# EAGLE design SparkFun_XBee_Serial_Explorer (EAGLE 7.5.0)
Assembly variants: Attributes
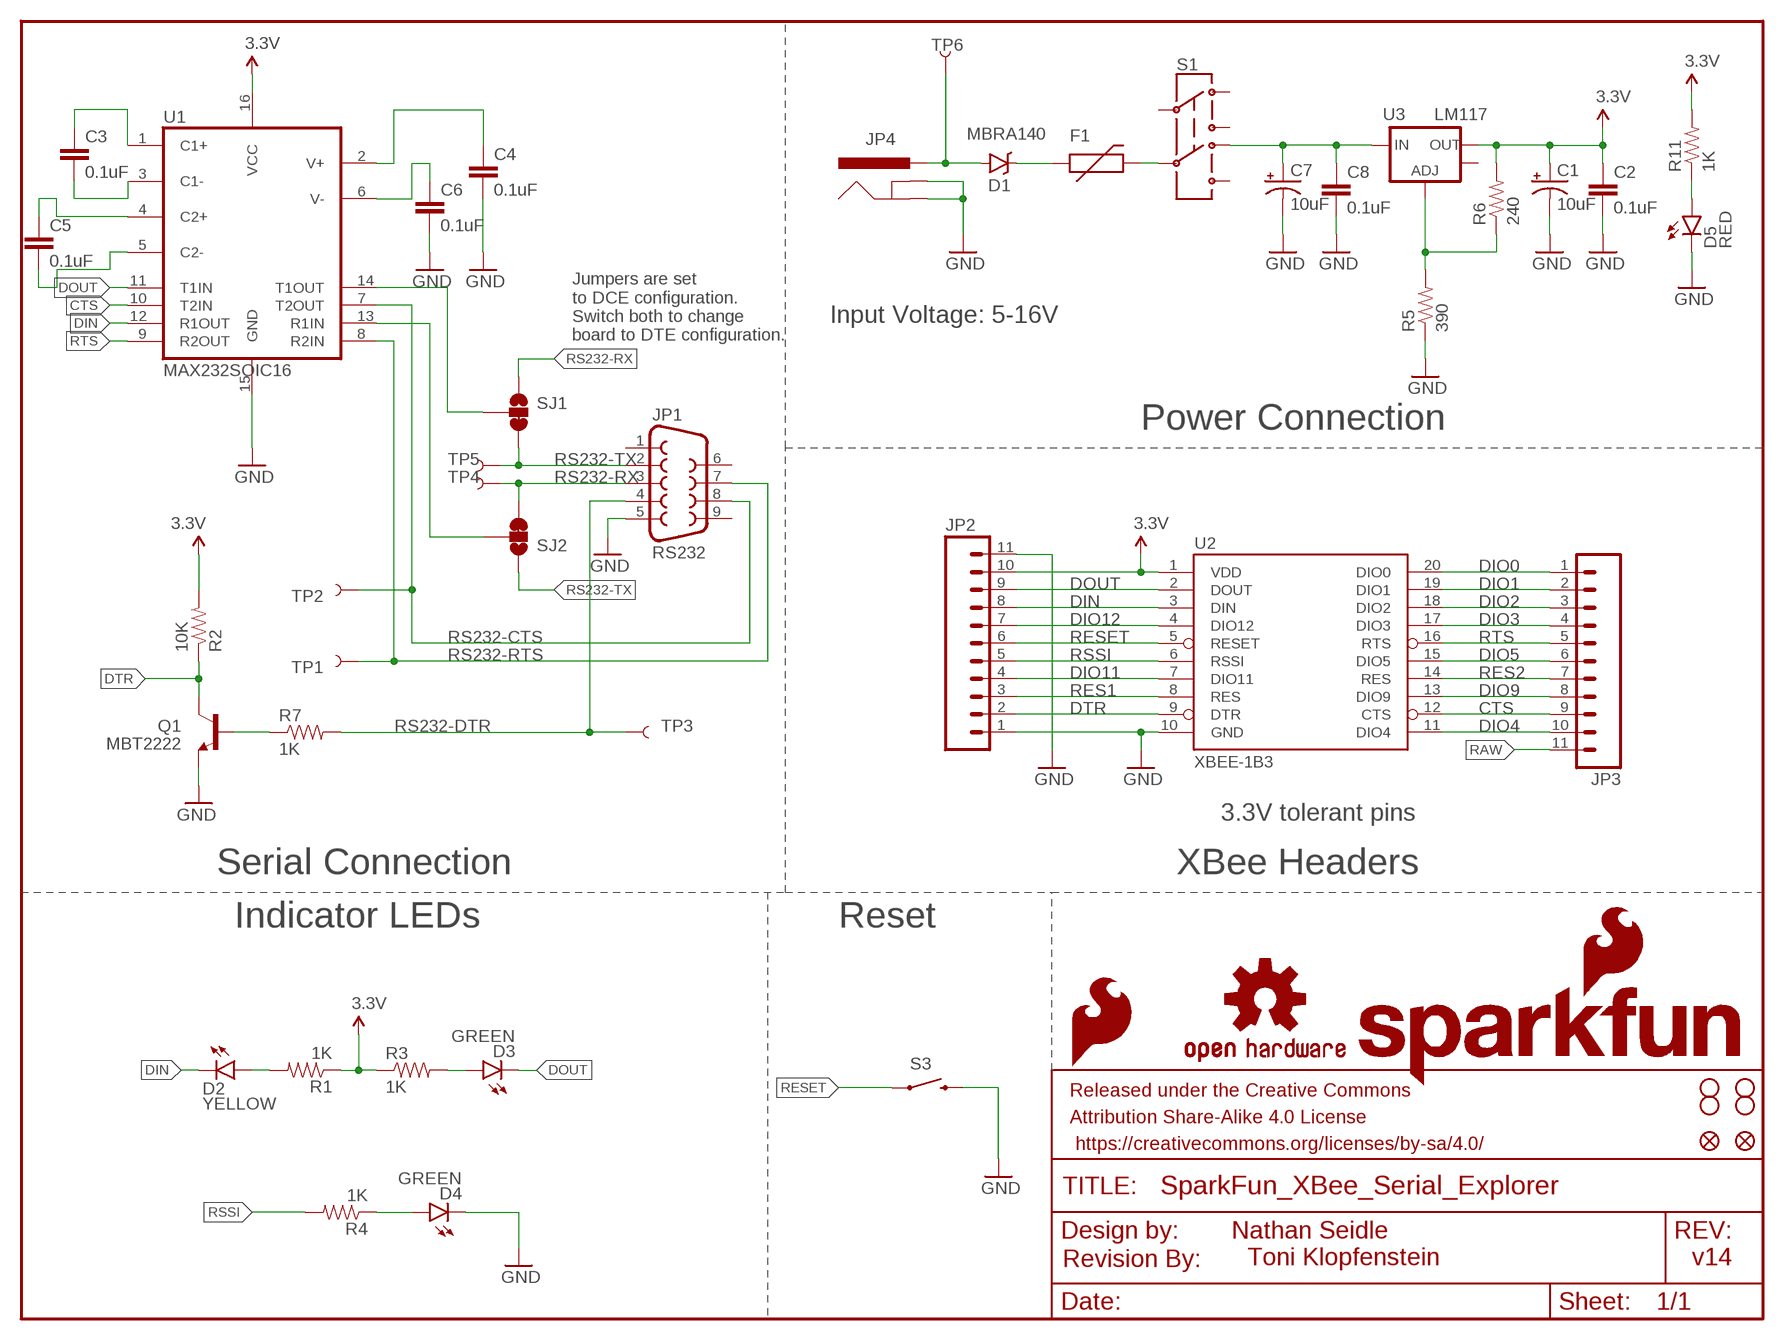
[diagram p0: schematic, sheet 1]

## Parts
C1  10uF  10UF-16V-10%(TANT)  [EIA3216]
C2  0.1uF  0.1UF-25V(+80/-20%)(0603)  [0603-CAP]
C3  0.1uF  0.1UF-25V(+80/-20%)(0603)  [0603-CAP]
C4  0.1uF  0.1UF-25V(+80/-20%)(0603)  [0603-CAP]
C5  0.1uF  0.1UF-25V(+80/-20%)(0603)  [0603-CAP]
C6  0.1uF  0.1UF-25V(+80/-20%)(0603)  [0603-CAP]
C7  10uF  10UF-16V-10%(TANT)  [EIA3216]
C8  0.1uF  0.1UF-25V(+80/-20%)(0603)  [0603-CAP]
D1  MBRA140  DIODE-SCHOTTKY-MBRA140  [SMA-DIODE]
D2  YELLOW  LED-YELLOWLARGE  [LED-1206]
D3  GREEN  LED-GREENLARGE  [LED-1206]
D4  GREEN  LED-GREENLARGE  [LED-1206]
D5  RED  LED-RED1206  [LED-1206]
F1  PTCTHERMISTOR1206  [PTC-1206]
FRAME1  FRAME-LETTER  [CREATIVE_COMMONS]
JP1  RS232  DB9FEMALE  [DB9]
JP2  M11PTH  [1X11]
JP3  M11PTH  [1X11]
JP4  POWER_JACKPTH_LOCK  [POWER_JACK_PTH_LOCK]
LOGO1  OSHW-LOGOL  [OSHW-LOGO-L]
LOGO2  SFE_LOGO_NAME_FLAME.2_INCH  [SFE_LOGO_NAME_FLAME_.2]
LOGO3  SFE_LOGO_FLAME.1_INCH  [SFE_LOGO_FLAME_.1]
Q1  MBT2222  TRANSISTOR_NPNSOT23-3  [SOT23-3]
R1  1K  1KOHM-1/10W-1%(0603)  [0603-RES]
R2  10K  10KOHM-1/10W-1%(0603)0603  [0603-RES]
R3  1K  1KOHM-1/10W-1%(0603)  [0603-RES]
R4  1K  1KOHM-1/10W-1%(0603)  [0603-RES]
R5  390  390OHM1/10W1%(0603)  [0603-RES]
R6  240  240OHM1/10W1%(0603)  [0603-RES]
R7  1K  1KOHM-1/10W-1%(0603)  [0603-RES]
R11  1K  1KOHM-1/10W-1%(0603)  [0603-RES]
S1  AYZ0202  [AYZ0202]
S3  TAC_SWITCHSMD  SWITCH-MOMENTARY-2SMD-REDUNDANT  [TACTILE-SWITCH-SMD]
SJ1  JUMPER-PAD-3-2OF3_NC_BY_TRACE_SMALL  [PAD-JUMPER-3-2OF3_NC_BY_TRACE_YES_SILK_FULL_BOX]
SJ2  JUMPER-PAD-3-2OF3_NC_BY_TRACE_SMALL  [PAD-JUMPER-3-2OF3_NC_BY_TRACE_YES_SILK_FULL_BOX]
TP1  TEST-POINTTP_15TH_THRU  [TP_15TH]
TP2  TEST-POINTTP_15TH_THRU  [TP_15TH]
TP3  TEST-POINTTP_15TH_THRU  [TP_15TH]
TP4  TEST-POINTTP_15TH_THRU  [TP_15TH]
TP5  TEST-POINTTP_15TH_THRU  [TP_15TH]
TP6  TEST-POINTTP_15TH_THRU  [TP_15TH]
U1  MAX232SOIC16  [SO016]
U2  XBEE-1B3  [XBEE-SMD]
U3  LM117  V_REG_LM1117SOT223  [SOT223]
U$1  REVISION  [REVISION]
U$5  STAND-OFF  [STAND-OFF]
U$7  FIDUCIAL1X2  [FIDUCIAL-1X2]
U$9  STAND-OFF  [STAND-OFF]
U$10  STAND-OFF  [STAND-OFF]
U$11  STAND-OFF  [STAND-OFF]
U$16  FIDUCIAL1X2  [FIDUCIAL-1X2]

## Nets
3.3V [vcc]: C1.A(+) C2.1 JP2.10 R1.1 R2.2 R3.1 R6.2 R11.2 U1.16(VCC) U2.1(VDD) U3.2(OUT)
CTS: JP3.9 U1.10(T2IN) U2.12(CTS)
DIN: D2.C JP2.8 U1.12(R1OUT) U2.3(DIN)
DIO0: JP3.1 U2.20(DIO0)
DIO1: JP3.2 U2.19(DIO1)
DIO2: JP3.3 U2.18(DIO2)
DIO3: JP3.4 U2.17(DIO3)
DIO4: JP3.10 U2.11(DIO4)
DIO5: JP3.6 U2.15(DIO5)
DIO9: JP3.8 U2.13(DIO9)
DIO11: JP2.4 U2.7(DIO11)
DIO12: JP2.7 U2.4(DIO12)
DOUT: D3.C JP2.9 U1.11(T1IN) U2.2(DOUT)
DTR: JP2.2 Q1.3(C) R2.1 U2.9(DTR)
GND [vcc]: C1.C(-) C2.2 C4.2 C6.2 C7.C(-) C8.2 D4.C D5.C JP1.5 JP2.1 JP2.11 JP4.GND JP4.GNDBREAK Q1.2(E) R5.1 S3.3 S3.4 U1.15(GND) U2.10(GND)
N$1: D2.A R1.2
N$2: D4.A R4.1
N$3: C3.1 U1.1(C1+)
N$4: D3.A R3.2
N$5: C3.2 U1.3(C1-)
N$6: C5.1 U1.4(C2+)
N$7: C5.2 U1.5(C2-)
N$8: C6.1 U1.6(V-)
N$9: C4.1 U1.2(V+)
N$10: R5.2 R6.1 U3.1(ADJ)
N$11: F1.2 S1.5
N$12: Q1.1(B) R7.1
N$13: SJ2.2 U1.13(R1IN)
N$14: SJ1.2 U1.14(T1OUT)
N$15: D1.A JP4.PWR TP6.P$1
N$16: D1.C F1.1
N$38: D5.A R11.1
RAW [vcc]: C7.A(+) C8.1 JP3.11 S1.6 U3.3(IN)
RES1: JP2.3 U2.8(RES)
RES2: JP3.7 U2.14(RES)
RESET: JP2.6 S3.1 S3.2 U2.5(RESET)
RS232-CTS: JP1.8 TP2.P$1 U1.7(T2OUT)
RS232-DTR: JP1.4 R7.2 TP3.P$1
RS232-RTS: JP1.7 TP1.P$1 U1.8(R2IN)
RS232-RX: JP1.3 SJ1.1 SJ2.3 TP4.P$1
RS232-TX: JP1.2 SJ1.3 SJ2.1 TP5.P$1
RSSI: JP2.5 R4.2 U2.6(RSSI)
RTS: JP3.5 U1.9(R2OUT) U2.16(RTS)
Unconnected: JP1.1 JP1.6 JP1.9 S1.1 S1.2 S1.3 S1.4 U3.4(OUT)

## Notes on the sheet
- Input Voltage: 5-16V
- Jumpers are set 
  to DCE configuration. 
  Switch both to change 
  board to DTE configuration.
- Power Connection
- 3.3V tolerant pins
- Serial Connection | XBee Headers
- Indicator LEDs | Reset
- Nathan Seidle
- Toni Klopfenstein | v14

## Library data of the parts
C1 C7 = SparkFun-Capacitors:10UF-16V-10%(TANT): CAP-00811 1206/EIA-3216 Tantalum capacitor; PROD_ID: CAP-00811
C2-C6 C8 = SparkFun-Capacitors:0.1UF-25V(+80/-20%)(0603): CAP-00810 Ceramic Standard decoupling cap; PROD_ID: CAP-00810
D1 = SparkFun-DiscreteSemi:DIODE-SCHOTTKY: Schottky diodes in SFE's production catalog BAT20J 1A 23V 0.62Vf RB751 120mA 40V 0.37Vf PMEG4005EJ 0.5A 40V 0.42Vf MBRA140 1A 40V 0.5Vf B340A 3A 40V SMA; PROD_ID: DIO-08053
D2 = SparkFun-LED:LED-YELLOW: Yellow SMD LEDs LilyPad 1206- DIO-09909 0603- DIO-09003; PROD_ID: DIO-00820
D3 D4 = SparkFun-LED:LED-GREEN: Various green LEDs Green LEDs used in SFE Production 0603- DIO-00821 LARGE- DIO-00862 LILYPAD- DIO-09910; PROD_ID: DIO-00862
D5 = SparkFun-LED:LED-RED: Assorted Red LEDs LilyPad 1206- DIO-09912 1206- DIO-00809 0603- DIO-00819; PROD_ID: DIO-00809
F1 = SparkFun-PowerIC:PTC: Resettable Fuse PTC Resettable Fuse. Spark Fun Electronics SKU : COM-08357; PROD_ID: RES-08585
FRAME1 = SparkFun-Aesthetics:FRAME-LETTER: Schematic Frame Standard 8.5x11 US Letter frame
JP1 = SparkFun-Connectors:DB9: DB9 Connector Standard DB9 (D-Sub 9) serial connector. Can be used for CAN bus as well as RS485 and RS232. Footprint production proven. Spark Fun Electronics SKU : PRT-00429; PROD_ID: CONN-08194
JP2 JP3 = SparkFun:M11: Header 11 Standard 11-pin 0.1" header. Use with straight break away headers (SKU : PRT-00116), right angle break away headers (PRT-00553), swiss pins (PRT-00743), machine pins (PRT-00117), and female headers (PRT-00115).
JP4 = SparkFun-Connectors:POWER_JACK: Power Jack This is the standard 5.5mm barrel jack for power. The PTH is the most common, proven, reliable, footprint. The Slot footprint only works if the mill layer is transmitted to the PCB fab house so be warned. Mating wall wart : TOL-00298 (and others); PROD_ID: CONN-08197; SF_ID: PRT-00119
LOGO1 = SparkFun-Aesthetics:OSHW-LOGO: Open Source Hardware Logo This logo indicates the piece of hardware it is found on incorporates a OSHW license and/or adheres to the definition of open source hardware found here: http://freedomdefined.org/OSHW
LOGO2 = SparkFun-Aesthetics:SFE_LOGO_NAME_FLAME: SFE Logo, name and flame This is the SparkFun full logo. The logo on the schematic will always be the same size; the package variant is the height of the flame part of the logo. Default layer for the logo on the board is tSilk.
LOGO3 = SparkFun-Aesthetics:SFE_LOGO_FLAME: SFE Logo, flame only This is the SparkFun flame logo. The logo on the schematic will always be the same size; the package variant is the height of the flame. Default layer for the logo on the board is tSilk.
Q1 = SparkFun-DiscreteSemi:TRANSISTOR_NPN: Generic NPN BJT MMBT2222A - TRANS-08049 (SOT-23, 1A 40V) MPSA42 - TRANS-09116 (SOT-23, 500mA 300V) MMBT5088LT1G - TRANS-11160 (SOT-23, 50 mA 30V) BC547 - COM-08928 <http://www.sparkfun.com/products/8928> (TO-92 45V 100mA) (1.Collector 2.Base 3.Emitter) 2N3904 - COM-00521 <http://www.sparkfun.com/products/521> (TO-92 40V 200mA) (1.Emitter 2.Base 3.Collector) P2N2222A - COM-12852 <http://www.sparkfun.com/products/12852> (TO-92 40V 600mA) (1.Collector 2.Base 3.Emitter); PROD_ID: TRANS-08049
R1 R3 R4 R7 R11 = SparkFun-Resistors:1KOHM-1/10W-1%(0603): RES-07856; PROD_ID: RES-07856
R2 = SparkFun-Resistors:10KOHM-1/10W-1%(0603): RES-00824; PROD_ID: RES-00824
R5 = SparkFun-Resistors:390OHM1/10W1%(0603): RES-07864; PROD_ID: RES-07864
R6 = SparkFun-Resistors:240OHM1/10W1%(0603): RES-07849; PROD_ID: RES-07849
S1 = SparkFun-Electromechanical:AYZ0202: SPDT Slide Switch Simple SMD single-pull double-throw slide switch. Good for less than 350mA power switch, switching UARTs between devices, etc. Spark Fun Electronics SKU : COM-00597; PROD_ID: SWCH-08179
S3 = SparkFun-Electromechanical:SWITCH-MOMENTARY-2: Various NO switches- pushbuttons, reed, etc; PROD_ID: SWCH-08247
SJ1 SJ2 = SparkFun-Passives:JUMPER-PAD-3-2OF3_NC_BY_TRACE
TP1-TP6 = SparkFun-Passives:TEST-POINT: Bare copper test points for troubleshooting or ICT
U1 = SparkFun-DigitalIC:MAX232: RS232 Transceiver Very common IC. This is generically called 'MAX232', but works with the 3V equivalent MAX3232 generic ICs. Field tested and mother approved. Spark Fun Electronics SKU : COM-00316 (DIP) and COM-00589 (SMD); PROD_ID: IC-08171
U2 = SparkFun-RF:XBEE-1: Xbee module footprints SMT header is CONN-09042.; PROD_ID: CONN-09042
U3 = SparkFun-PowerIC:V_REG_LM1117: Voltage Regulator LM1117 Standard adjustable voltage regulator but in SMD form. Spark Fun Electronics SKU : COM-00595; PROD_ID: VREG-08170
U$1 = SparkFun-Aesthetics:REVISION
U$5 U$9-U$11 = SparkFun-Electromechanical:STAND-OFF: #4 Stand Off This is the mechanical footprint for a #4 phillips button head screw. Use the keepout ring to avoid running the screw head into surrounding components. SKU : PRT-00447
U$7 U$16 = SparkFun-Aesthetics:FIDUCIAL: Fiducial Alignment Points Various fiducial points for machine vision alignment.

## Net classes
0 default: width 0.203 mm
1 vcc: width 0.305 mm
2 gnd: width 0.254 mm

## Board
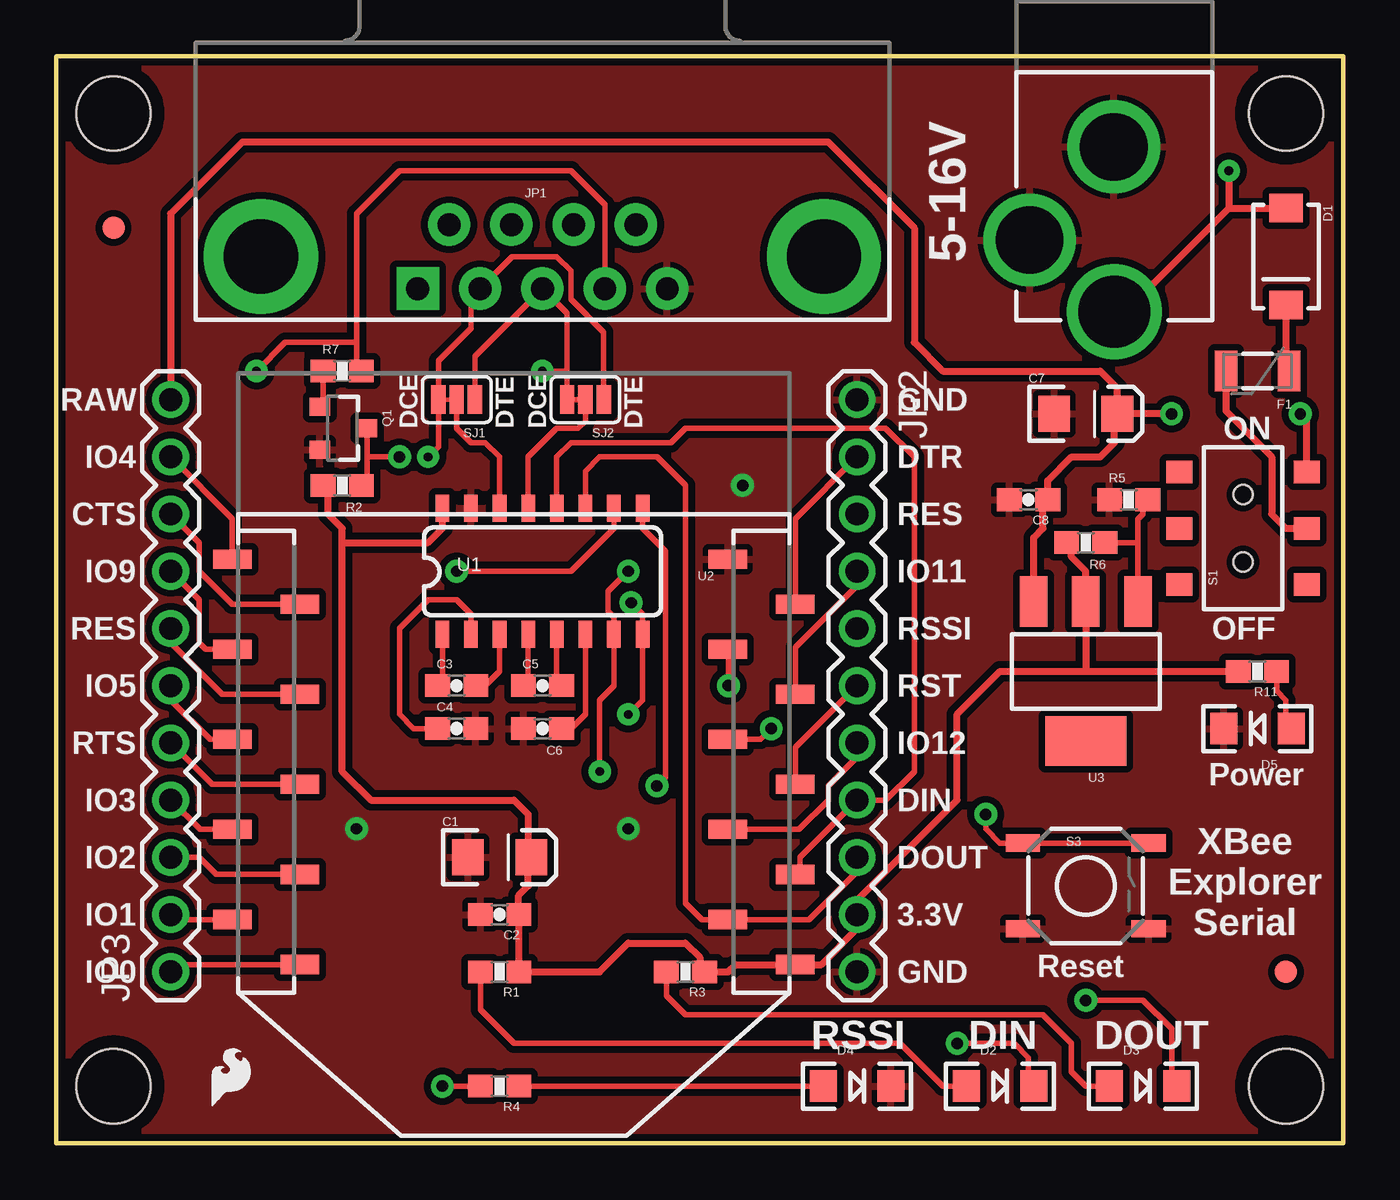
[diagram p1: board, top side]
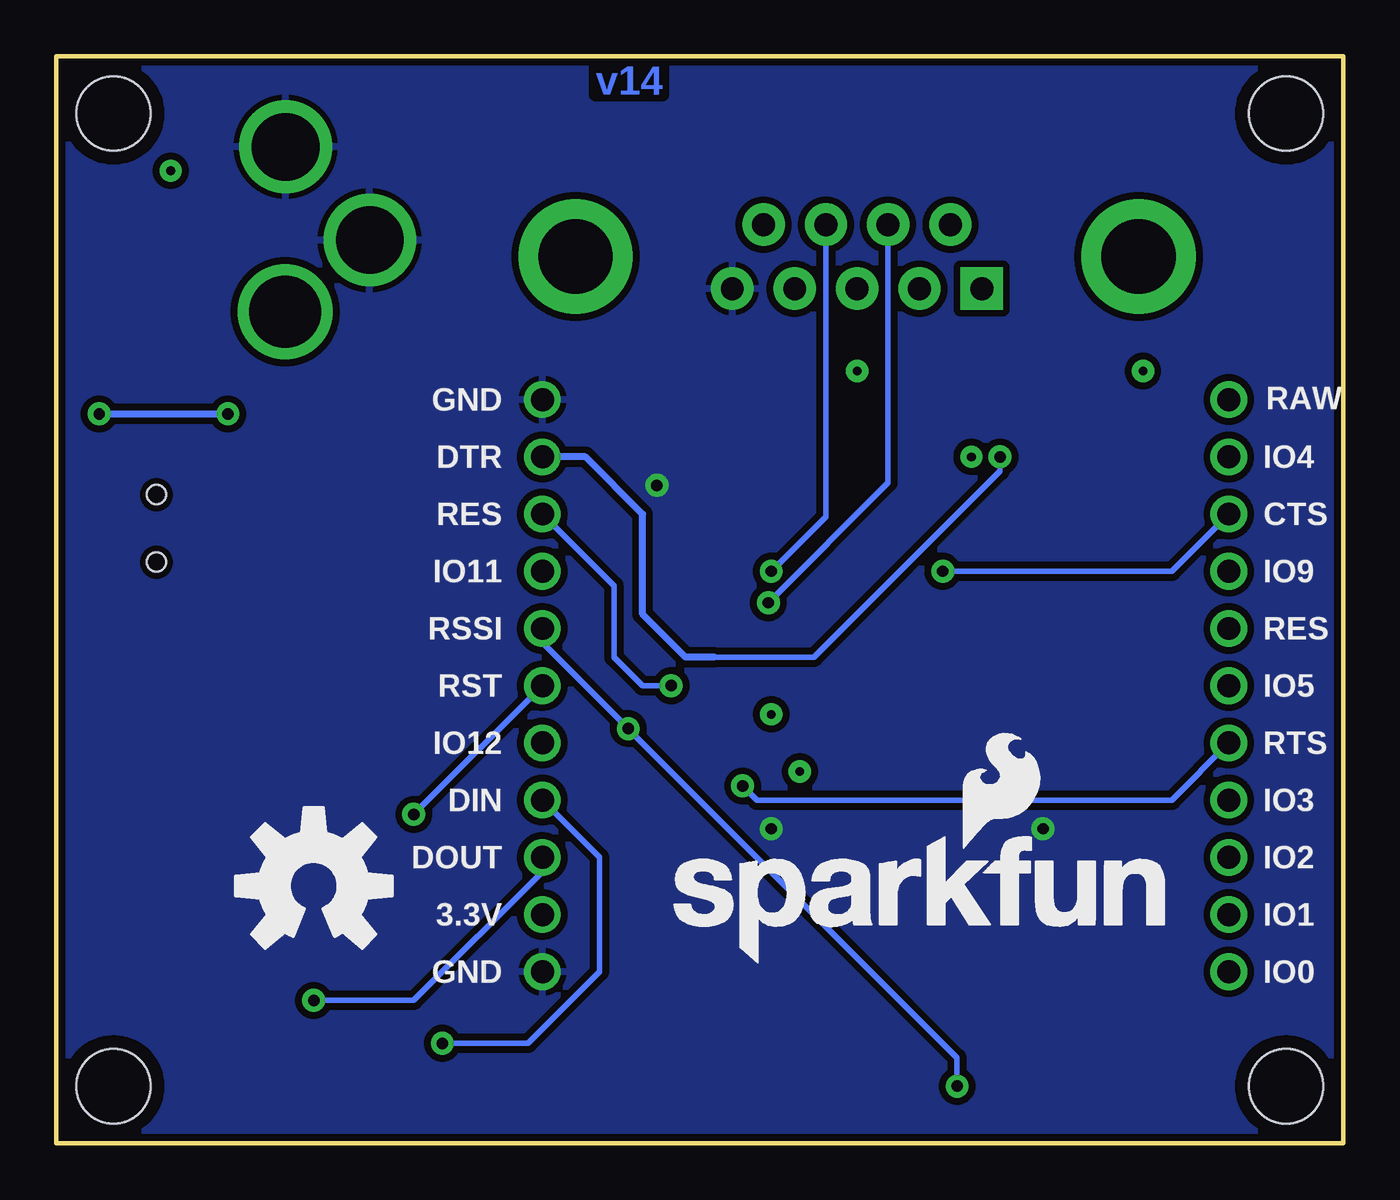
[diagram p2: board, bottom side, seen from below]

Size 57.15 x 48.26 mm. Coordinates in mm from the lower left corner, seen from the top.
Outline: 0,48.26 0,0 57.15,0 57.15,48.26 0,48.26
Copper layers (1*16): Top 0.035mm / dielectric 1.5mm / Bottom 0.035mm
Design rules "SparkFun-2-layer": minimum track width 7mil, minimum drill 15mil, track to track 8mil, track to pad 8mil, pad to pad 8mil, via to via 8mil, smd to smd 8mil, copper to edge 8mil, drill to drill 8mil, minimum pad ring 12mil, minimum via ring 10mil, stop-mask expansion 4mil, vias tented up to drill 20mil, thermal gap 10mil

### Footprints (pad centres in the part's own frame; a part is rotated, then mirrored left to right if it is on the bottom)
EIA3216 = smd 1.4 x 1.6: A 1.4,0; C -1.4,0
0603-CAP = smd 1.1 x 1: 1 -0.85,0; 2 0.85,0
SMA-DIODE = smd 1.27 x 1.47: A -2.15,0; C 2.15,0
LED-1206 = smd 1.2 x 1.4: A -1.5,0; C 1.5,0
PTC-1206 = smd 1 x 1.8: 1 -1.4,0; 2 1.4,0
DB9 = drill 1.016 pad 1.88 square: 1 -5.54,-1.42 | drill 1.016 pad 1.88: 2 -2.77,-1.42; 3 0,-1.42; 4 2.77,-1.42; 5 5.54,-1.42; 6 -4.15,1.42; 7 -1.38,1.42; 8 1.38,1.42; 9 4.15,1.42 | drill 3.302 pad 5.08: G1 -12.5,0; G2 12.5,0
1X11 = drill 1.016: 1 0,0; 2 2.54,0; 3 5.08,0; 4 7.62,0; 5 10.16,0; 6 12.7,0; 7 15.24,0; 8 17.78,0; 9 20.32,0; 10 22.86,0; 11 25.4,0
POWER_JACK_PTH_LOCK = drill 2.997 pad 4.115: GND 0.025,6.557; GNDBREAK 3.762,10.7 | drill 3.2 pad 4.115: PWR 0,13.878
SOT23-3 = smd 0.8 x 0.9: 1 -0.95,-1; 2 0.95,-1; 3 0,1.1
0603-RES = smd 1.1 x 1: 1 -0.85,0; 2 0.85,0
AYZ0202 = smd 1 x 1.15: 1 -2.5,2.825; 2 0,2.825; 3 2.5,2.825; 4 -2.5,-2.825; 5 0,-2.825; 6 2.5,-2.825 | hole 0.85: 1.5,0; -1.5,0
TACTILE-SWITCH-SMD = smd 1.524 x 0.762: 1 -2.794,1.905; 2 2.794,1.905; 3 -2.794,-1.905; 4 2.794,-1.905
PAD-JUMPER-3-2OF3_NC_BY_TRACE_YES_SILK_FULL_BOX = smd 0.635 x 1.27: 1 -0.813,0; 2 0,0; 3 0.813,0
TP_15TH = drill 0.381 pad 0.61: P$1 0,0
SO016 = smd 0.6 x 1.2: 1 -4.445,-2.8; 2 -3.175,-2.8; 3 -1.905,-2.8; 4 -0.635,-2.8; 5 0.635,-2.8; 6 1.905,-2.8; 7 3.175,-2.8; 8 4.445,-2.8; 9 4.445,2.8; 10 3.175,2.8; 11 1.905,2.8; 12 0.635,2.8; 13 -0.635,2.8; 14 -1.905,2.8; 15 -3.175,2.8; 16 -4.445,2.8
XBEE-SMD = smd 1.7 x 0.85: 1 -12.5,20; 2 -9.5,18; 3 -12.5,16; 4 -9.5,14; 5 -12.5,12; 6 -9.5,10; 7 -12.5,8; 8 -9.5,6; 9 -12.5,4; 10 -9.5,2; 11 12.5,2; 12 9.5,4; 13 12.5,6; 14 9.5,8; 15 12.5,10; 16 9.5,12; 17 12.5,14; 18 9.5,16; 19 12.5,18; 20 9.5,20
SOT223 = smd 1.219 x 2.235: 1 -2.311,-3.099; 2 0,-3.099; 3 2.311,-3.099 | smd 3.6 x 2.2: 4 0,3.099
STAND-OFF = hole 3.302: 0,0
FIDUCIAL-1X2 = smd 1 x 1: 1 0,0

### Placement (x,y rotation side)
C1  19.68,12.7 0 top
C2  19.68,10.16 180 top
C3  17.78,20.32 0 top
C4  17.78,18.41 0 top
C5  21.59,20.32 0 top
C6  21.59,18.41 180 top
C7  45.72,32.38 0 top
C8  43.18,28.57 180 top
D1  54.61,39.37 270 top
D2  41.91,2.54 0 top
D3  48.26,2.54 0 top
D4  35.56,2.54 0 top
D5  53.34,18.41 180 top
F1  53.34,34.29 180 top
FRAME1  -0.82,-14.07 0 top  (outside the outline)
JP1  21.59,39.37 0 top
JP2  35.56,33.02 270 top
JP3  5.08,7.62 90 top
JP4  46.99,50.8 180 top
LOGO1  45.72,11.43 0 bottom
LOGO2  30.43,7.92 0 bottom
LOGO3  6.6,1.32 0 top
Q1  12.7,31.75 270 top
R1  19.68,7.62 180 top
R2  12.7,29.21 180 top
R3  27.94,7.62 180 top
R4  19.68,2.54 180 top
R5  47.62,28.57 0 top
R6  45.72,26.67 180 top
R7  12.7,34.29 0 top
R11  53.34,20.95 180 top
S1  52.7,27.3 90 top
S3  45.72,11.43 0 top
SJ1  17.78,33.02 180 top
SJ2  23.5,33.02 180 top
TP1  25.4,19.05 0 top
TP2  24.13,16.51 0 top
TP3  8.89,34.29 0 top
TP4  21.59,34.29 0 top
TP5  16.51,30.48 0 top
TP6  52.07,43.18 0 top
U1  21.59,25.4 0 top
U2  20.32,27.94 180 top
U3  45.72,20.95 180 top
U$1  11.48,-16.61 0 top  (outside the outline)
U$5  2.54,2.54 270 top
U$7  2.54,40.64 270 top
U$9  54.61,2.54 270 top
U$10  54.61,45.72 270 top
U$11  2.54,45.72 270 top
U$16  54.61,7.62 270 top

### Tracks (layer width: path | path; a pad name or v marks a point on that pad's centre or on a via)
3.3V
  Top 0.305: 12.7,26.67 16.51,26.67 17.14,27.3 U1.16 | 12.7,26.67 12.7,16.51 13.97,15.24 20.32,15.24 20.95,14.61 20.95,12.83 C1.A 20.95,12.57 20.95,11.43 20.54,11.01 C2.1 R1.1 24.13,7.62 25.4,8.89 27.94,8.89 28.57,8.26 28.57,7.83 R3.1 29.84,7.62 30.16,7.94 U2.1 33.98,7.94 35.56,9.53 JP2.10 35.56,10.79 40.01,15.24 40.01,19.05 41.91,20.95 45.72,20.95 | 12.7,26.67 12.7,27.3 12.06,27.94 12.06,29 R2.2 | 45.72,20.95 R11.2 | 45.72,20.95 U3.2 45.72,25.4 45.09,26.04 45.09,26.45 R6.2
CTS  (via drill 0.51)
  Top 0.254: U1.10 24.77,27.3 22.86,25.4 v17.78,25.4 | U2.12 7.81,23.94 6.35,25.4 6.35,26.67 JP3.9
  Bottom 0.254: v17.78,25.4 7.62,25.4 JP3.9
DIN  (via drill 0.51)
  Top 0.254: U2.3 33.02,11.94 33.02,12.7 JP2.8 36.83,15.24 38.1,16.51 38.1,30.48 36.83,31.75 27.94,31.75 27.3,31.11 22.86,31.11 22.23,30.48 U1.12 22.23,28.7 22.35,28.57 | v40.01,4.45 42.55,4.45 43.18,3.81 43.18,2.77 D2.C
  Bottom 0.254: JP2.8 33.02,12.7 33.02,7.62 36.2,4.45 v40.01,4.45
DIO0
  Top 0.254: U2.20 5.4,7.94 JP3.1
DIO1
  Top 0.254: U2.19 5.3,9.94 JP3.2
DIO2
  Top 0.254: U2.18 7.11,11.94 6.35,12.7 JP3.3
DIO3
  Top 0.254: U2.17 6.38,13.94 JP3.4
DIO4
  Top 0.254: U2.11 7.82,27.74 JP3.10
DIO5
  Top 0.254: U2.15 6.83,17.94 5.08,19.68 JP3.6
DIO9
  Top 0.254: U2.13 6.63,21.94 6.35,22.23 6.35,24.13 JP3.8
DIO11
  Top 0.254: U2.7 32.82,22.02 35.56,24.77 JP2.4
DIO12
  Top 0.254: U2.4 32.99,13.94 34.29,15.24 34.29,15.88 35.56,17.14 JP2.7
DOUT  (via drill 0.51)
  Top 0.254: U1.11 23.5,29.84 24.13,30.48 26.67,30.48 27.94,29.21 27.94,10.67 28.67,9.94 U2.2 33.44,9.94 35.56,12.06 JP2.9 | v45.72,6.35 48.26,6.35 49.53,5.08 49.53,2.77 D3.C
  Bottom 0.254: JP2.9 35.56,12.06 41.27,6.35 v45.72,6.35
DTR  (via drill 0.51)
  Top 0.254: U2.9 32.82,27.74 JP2.2 | Q1.3 13.8,30.48 | 13.8,30.48 13.8,29.46 R2.1 | v15.24,30.48 13.8,30.48
  Bottom 0.254: 27.94,21.59 23.5,21.59 15.24,29.84 v15.24,30.48
  Bottom 0.305: 27.94,21.59 29.21,21.59 31.11,23.5 31.11,27.94 33.66,30.48 JP2.2
GND  (via drill 0.51)
  other vias: 30.48,29.21 25.4,13.97 13.34,13.97
  pour Bottom (isolate 0.305): 57.15,48.26 57.15,0 0,0 0,48.26
  pour Top (isolate 0.305): 57.15,48.26 57.15,0 0,0 0,48.26
N$1
  Top 0.254: D2.A 39.37,2.54 37.47,4.45 20.32,4.45 18.84,5.93 R1.2
N$2
  Top 0.254: R4.1 D4.A
N$3
  Top 0.254: U1.1 17.14,20.54 C3.1
N$4
  Top 0.254: D3.A 45.72,2.54 45.09,3.17 45.09,4.45 43.81,5.71 27.94,5.71 27.09,6.57 R3.2
N$5
  Top 0.254: U1.3 19.68,20.95 19.05,20.32 C3.2
N$6
  Top 0.254: U1.4 20.95,20.54 C5.1
N$7
  Top 0.254: U1.5 22.23,20.54 C5.2
N$8
  Top 0.254: C6.1 22.86,18.41 23.5,19.05 U1.6
N$9
  Top 0.254: U1.2 18.41,23.5 17.78,24.13 16.51,24.13 15.24,22.86 15.24,19.05 15.88,18.41 C4.1
N$10
  Top 0.254: U3.1 48.03,26.67 | 48.03,26.67 48.03,27.71 48.26,27.94 48.26,28.36 R5.2 | R6.1 48.03,26.67
N$11
  Top 0.305: F1.2 51.94,32.52 53.98,30.48 53.98,27.94 54.61,27.3 S1.5
N$12
  Top 0.254: R7.1 11.85,32.85 Q1.1
N$13
  Top 0.254: U1.13 20.95,30.48 22.23,31.75 23.18,31.75 23.5,32.07 SJ2.2 22.86,33.02
N$14
  Top 0.254: U1.14 19.68,30.48 19.05,31.11 18.41,31.11 17.78,31.75 SJ1.2
N$15
  Top 0.305: TP6.P$1 52.07,41.52 | JP4.PWR 47.47,36.92 52.07,41.52 | 52.07,41.52 D1.A
N$16
  Top 0.305: D1.C 54.61,34.42 F1.1
N$38
  Top 0.254: R11.1 54.19,20.11 54.61,19.68 54.61,18.64 D5.A
RAW  (via drill 0.51)
  Top 0.305: JP3.11 5.08,41.27 8.26,44.45 34.29,44.45 38.1,40.64 38.1,35.56 39.37,34.29 46.35,34.29 47.12,33.52 C7.A | v49.53,32.38 C7.A | U3.3 43.41,26.9 43.81,27.3 43.81,28.36 C8.1 44.03,29.43 45.09,30.48 46.35,30.48 46.99,31.11 46.99,32.26 C7.A | S1.6 55.53,32.1 v55.24,32.38
  Bottom 0.305: v55.24,32.38 v49.53,32.38
RES1  (via drill 0.51)
  Top 0.254: U2.8 29.84,21.91 v29.84,20.32
  Bottom 0.254: JP2.3 32.38,24.77 32.38,21.59 31.11,20.32 v29.84,20.32
RES2
  Top 0.254: U2.14 7.37,19.94 5.08,22.23 JP3.7
RESET  (via drill 0.51)
  Top 0.254: v41.27,14.61 41.27,13.97 41.91,13.34 S3.1 S3.2 48.9,13.34 | U2.5 32.82,17.58 JP2.6
  Bottom 0.254: JP2.6 v41.27,14.61
RS232-CTS  (via drill 0.51)
  Top 0.254: v25.4,25.4 24.51,24.51 24.51,23.62 24.77,23.37 U1.7 24.77,20.32 24.13,19.68 TP2.P$1
  Bottom 0.254: JP1.8 22.97,27.83 v25.4,25.4
RS232-DTR
  Top 0.254: JP1.4 24.36,41.68 22.86,43.18 15.24,43.18 13.34,41.27 13.34,35.56 | 13.34,35.56 13.34,34.51 R7.2 | TP3.P$1 10.16,35.56 13.34,35.56
RS232-RTS  (via drill 0.51)
  Top 0.254: v25.53,24 26.04,23.5 U1.8 26.04,19.68 TP1.P$1
  Bottom 0.254: v25.53,24 20.21,29.32 JP1.7
RS232-RX
  Top 0.254: SJ1.1 18.59,34.95 JP1.3 22.68,36.86 22.68,34.29 | SJ2.3 22.68,34.29 | TP4.P$1 22.68,34.29
RS232-TX
  Top 0.254: SJ2.1 24.31,36.02 22.86,37.47 22.86,38.73 22.23,39.37 20.24,39.37 JP1.2 18.41,37.55 18.41,36.2 16.97,34.75 SJ1.3 16.97,30.94 TP5.P$1
RSSI  (via drill 0.51)
  Top 0.254: R4.2 v17.14,2.54 | U2.6 31.27,17.94 v31.75,18.41
  Bottom 0.254: JP2.5 35.56,22.23 32.07,18.73 v31.75,18.41 17.14,3.81 v17.14,2.54
RTS  (via drill 0.51)
  Top 0.254: 10.79,15.75 10.82,15.77 U2.16 6.92,15.94 JP3.5 | U1.9 26.04,27.3 27.05,26.29 27.05,16.26 v26.67,15.88
  Bottom 0.254: JP3.5 7.62,15.24 26.04,15.24 v26.67,15.88

### Text on the board
Bottom: v14
tPlace: 5-16V | RAW | GND | DCE | DTE | DCE | DTE | ON | IO4 | DTR | CTS | RES | IO9 | IO11 | RES | RSSI | OFF | IO5 | RST | RTS | IO12 | Power | IO3 | DIN | XBee / Explorer / Serial | IO2 | DOUT | IO1 | 3.3V | IO0 | GND | Reset | RSSI | DIN | DOUT
bPlace: RAW | GND | IO4 | DTR | CTS | RES | IO9 | IO11 | RES | RSSI | IO5 | RST | RTS | IO12 | IO3 | DIN | IO2 | DOUT | IO1 | 3.3V | IO0 | GND
tDocu: Nathan Seidle | Toni Klopfenstein